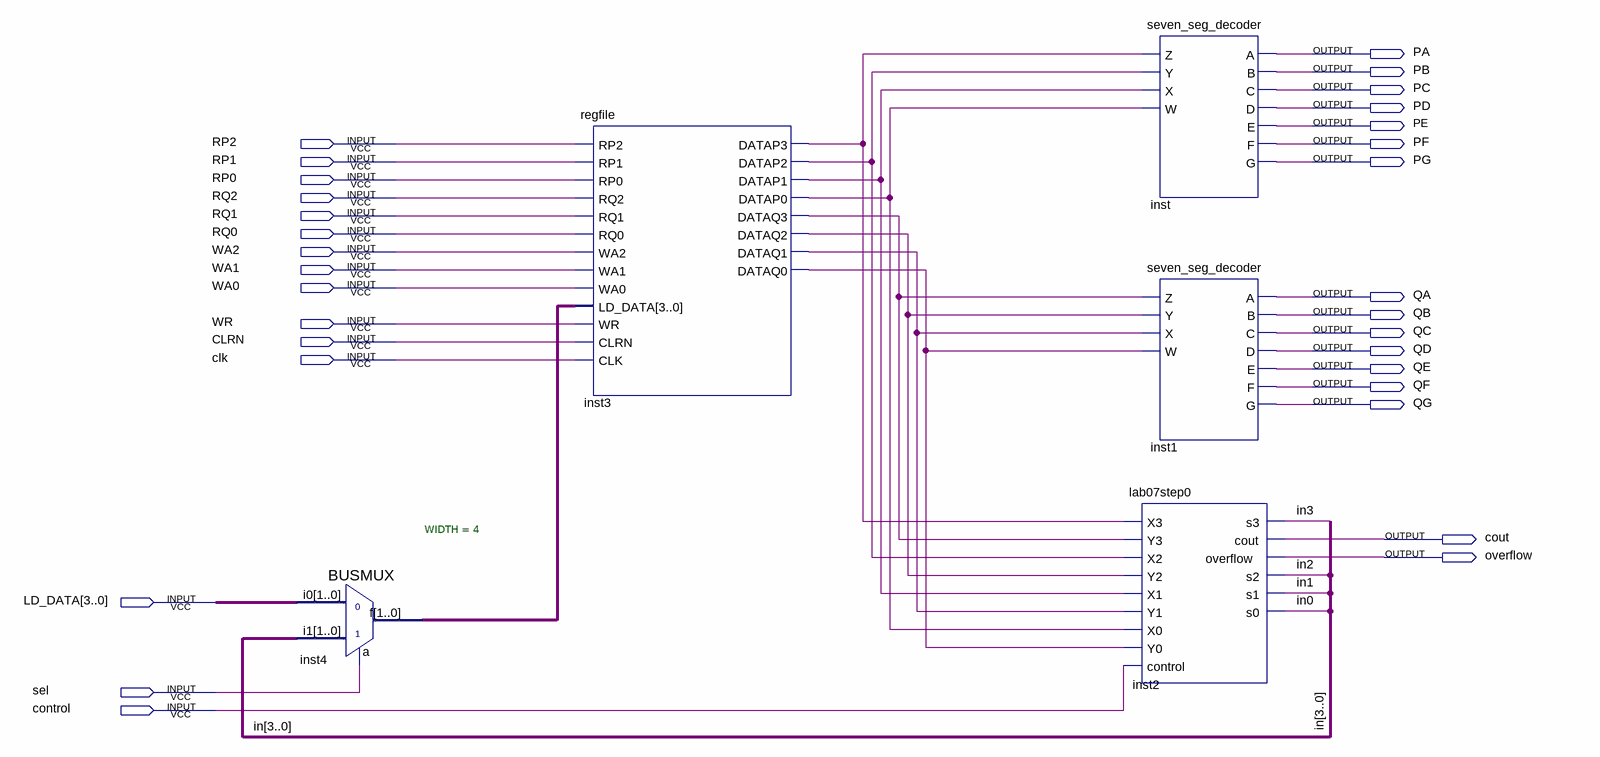
[diagram p0: schematic sheet]
// Quartus schematic lab12step3.bdf as structural Verilog: 5 symbols, 31 pins
module lab12step3 (
  input  RP2,
  input  RP1,
  input  RP0,
  input  RQ2,
  input  RQ1,
  input  RQ0,
  input  WA2,
  input  WA1,
  input  WA0,
  input  WR,
  input  CLRN,
  input  clk,
  input  [3:0] LD_DATA,
  input  sel,
  input  control,
  output PA,
  output PB,
  output PC,
  output PD,
  output PE,
  output PF,
  output PG,
  output QA,
  output QB,
  output QC,
  output QD,
  output QE,
  output QF,
  output QG,
  output cout,
  output overflow
);

  wire inst3_datap0, inst3_datap1, inst3_datap2, inst3_datap3, inst3_dataq0, inst3_dataq1, inst3_dataq2,
       inst3_dataq3;
  wire [3:0] in, inst4_result;

  BUSMUX #(.WIDTH(4)) inst4 (.dataa(LD_DATA), .datab(in), .sel(sel), .result(inst4_result));
  regfile inst3 (
    .RP2(RP2), .RP1(RP1), .RP0(RP0), .RQ2(RQ2), .RQ1(RQ1), .RQ0(RQ0), .WA2(WA2), .WA1(WA1), .WA0(WA0),
    .LD_DATA(inst4_result), .WR(WR), .CLRN(CLRN), .CLK(clk), .DATAP3(inst3_datap3), .DATAP2(inst3_datap2),
    .DATAP1(inst3_datap1), .DATAP0(inst3_datap0), .DATAQ3(inst3_dataq3), .DATAQ2(inst3_dataq2),
    .DATAQ1(inst3_dataq1), .DATAQ0(inst3_dataq0));
  seven_seg_decoder inst (
    .Z(inst3_datap3), .Y(inst3_datap2), .X(inst3_datap1), .W(inst3_datap0), .A(PA), .B(PB), .C(PC), .D(PD),
    .E(PE), .F(PF), .G(PG));
  seven_seg_decoder inst1 (
    .Z(inst3_dataq3), .Y(inst3_dataq2), .X(inst3_dataq1), .W(inst3_dataq0), .A(QA), .B(QB), .C(QC), .D(QD),
    .E(QE), .F(QF), .G(QG));
  lab07step0 inst2 (
    .X3(inst3_datap3), .Y3(inst3_dataq3), .X2(inst3_datap2), .Y2(inst3_dataq2), .X1(inst3_datap1),
    .Y1(inst3_dataq1), .X0(inst3_datap0), .Y0(inst3_dataq0), .control(control), .s3(in[3]), .cout(cout),
    .overflow(overflow), .s2(in[2]), .s1(in[1]), .s0(in[0]));
endmodule
